# EAGLE design B (EAGLE 7.6.0)
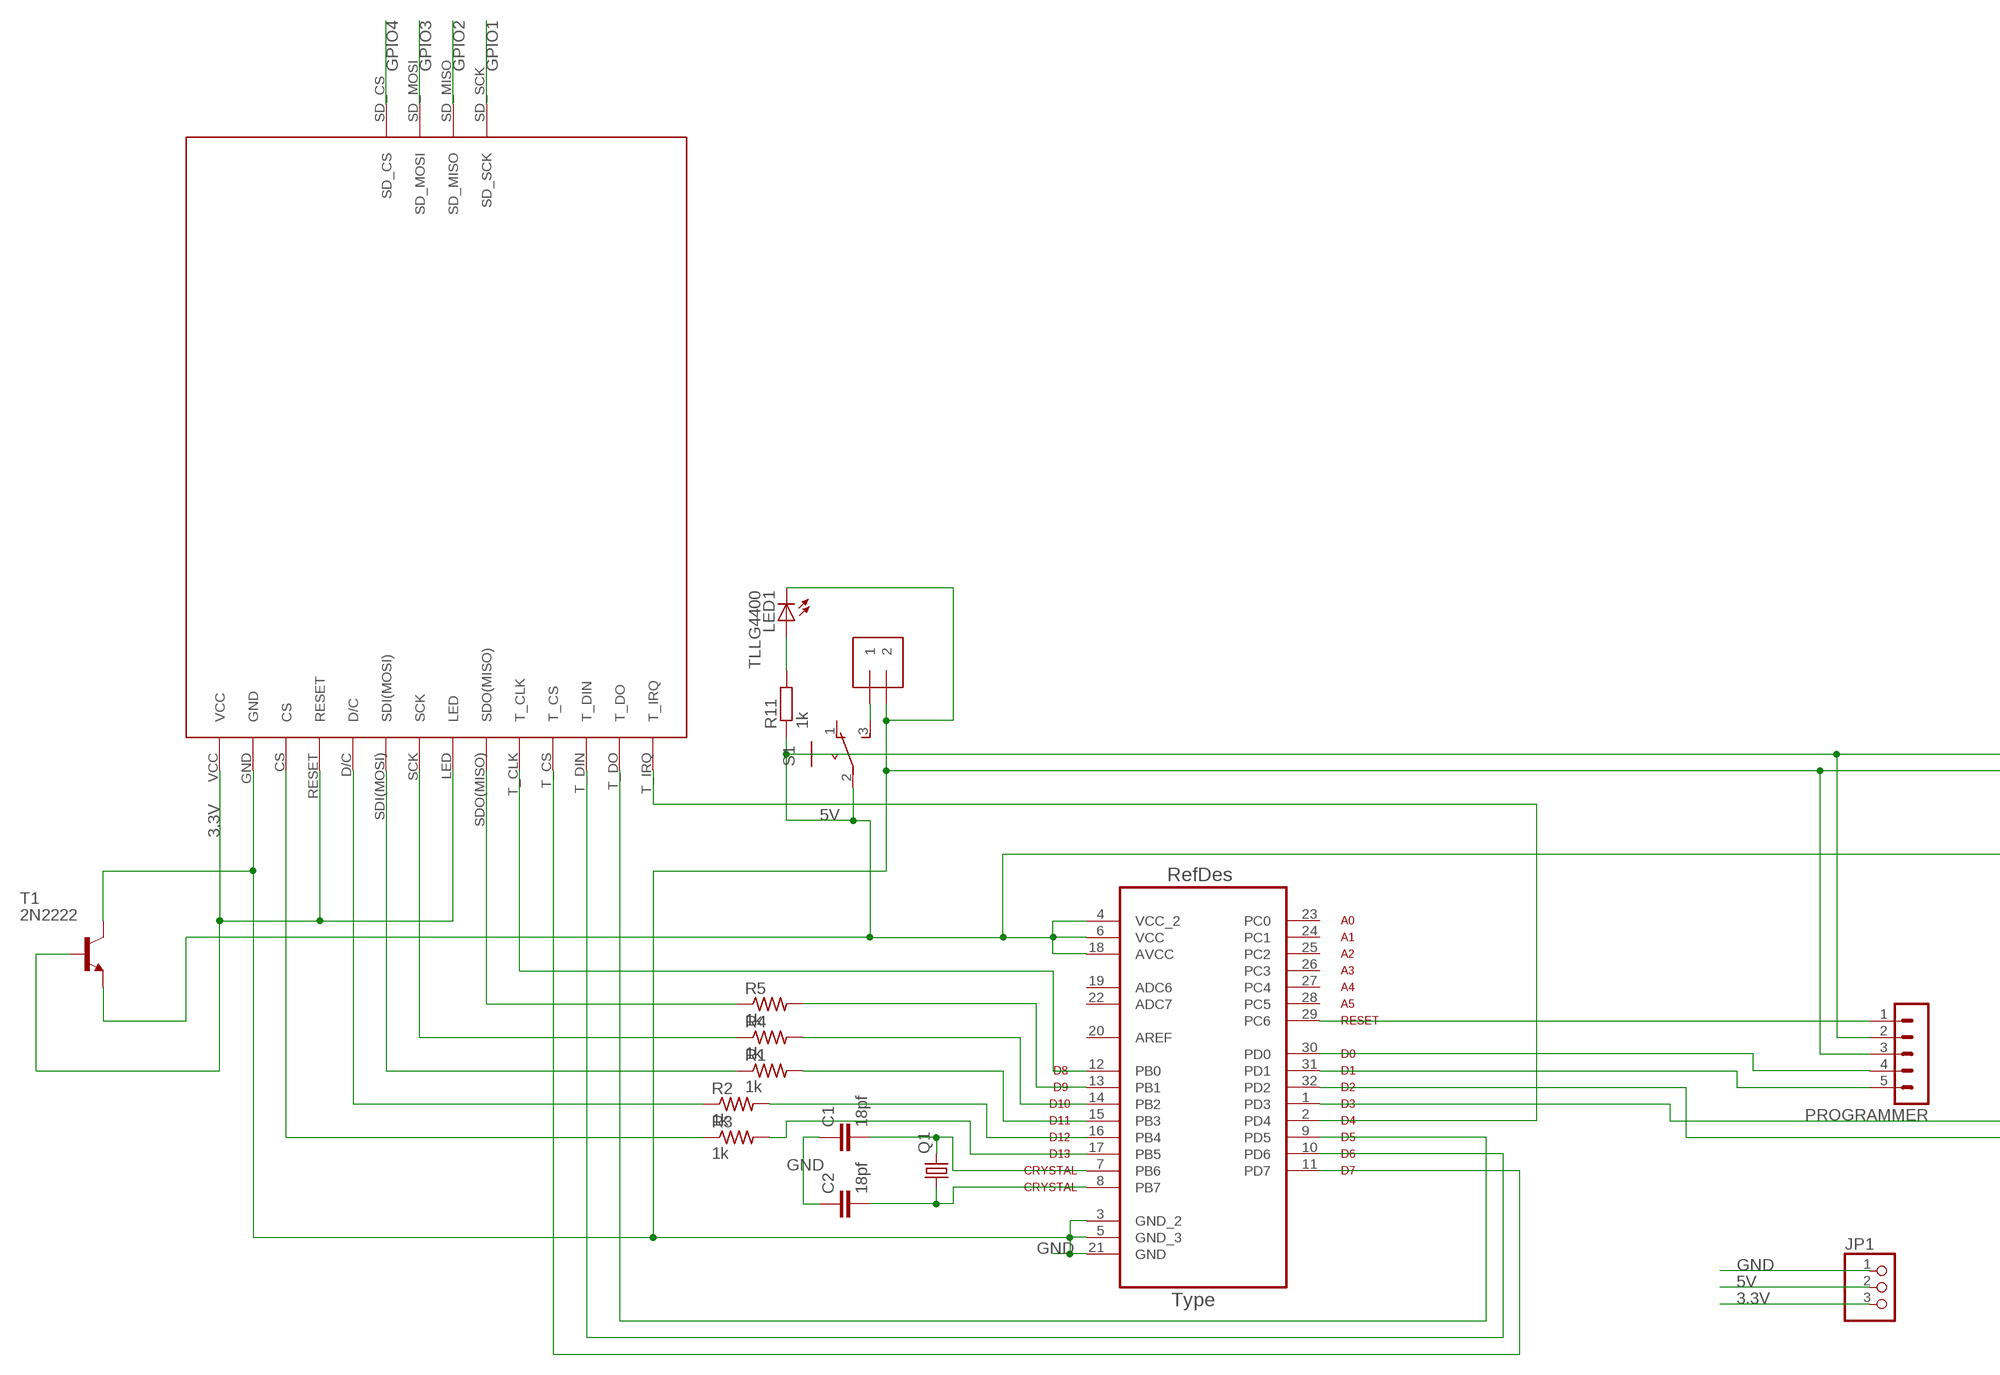
[diagram p0: schematic, sheet 1, part 1 of 2]
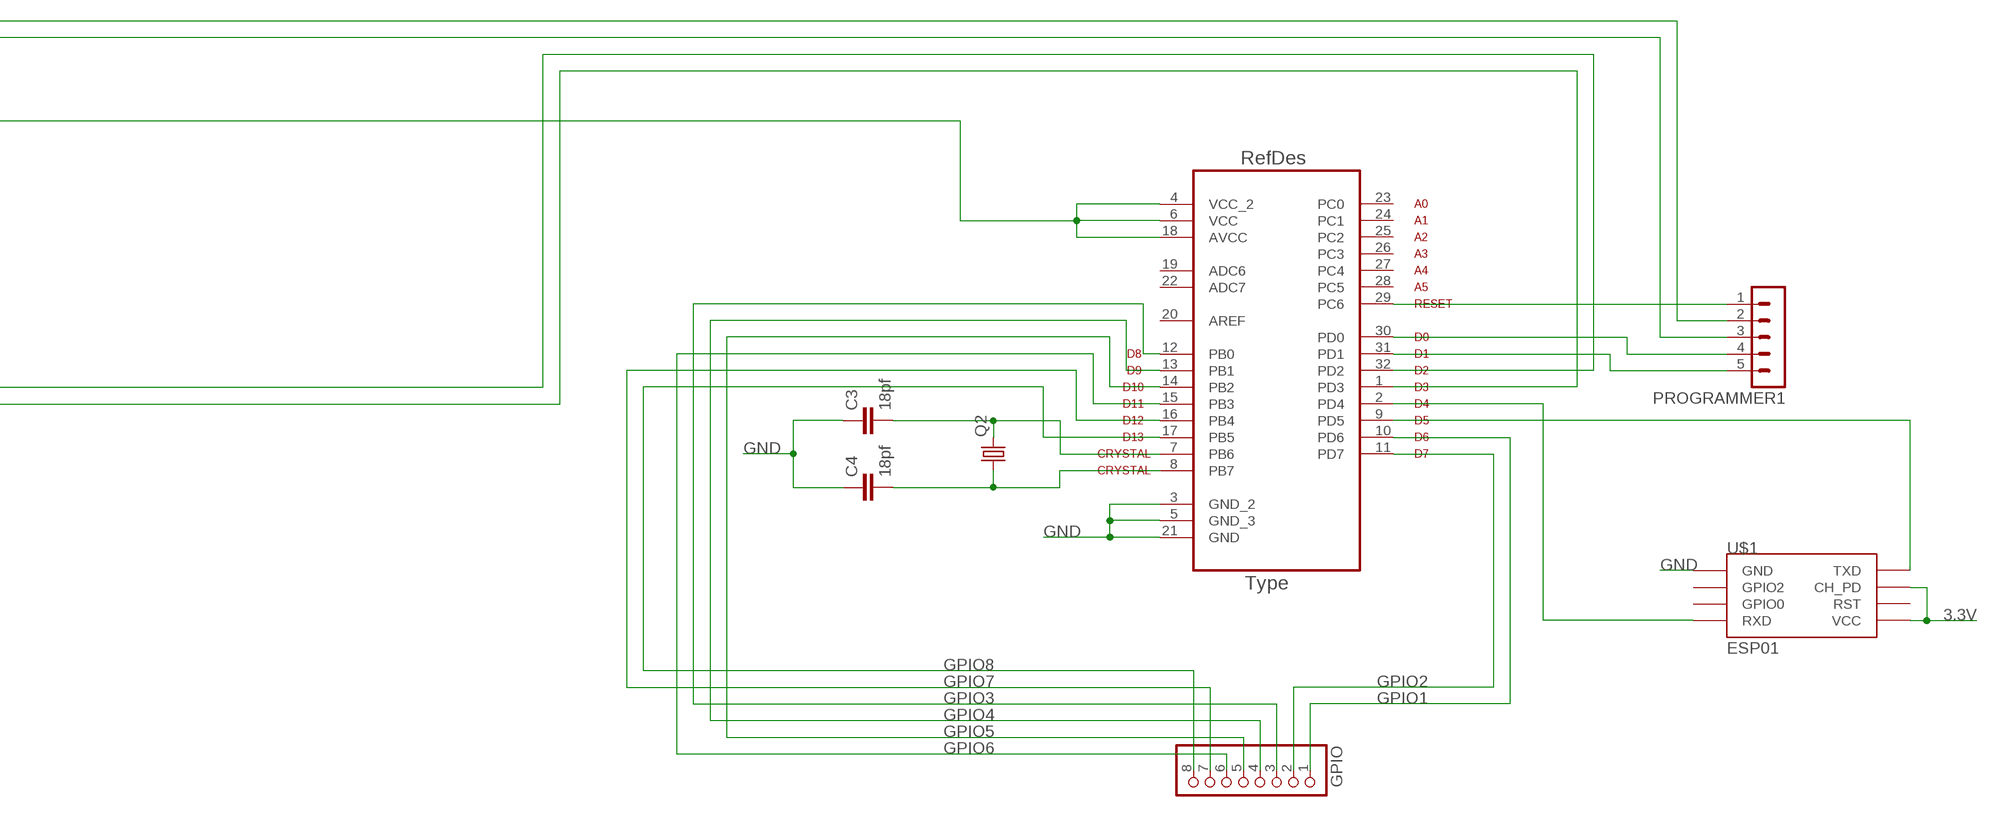
[diagram p1: schematic, sheet 1, part 2 of 2]

## Parts
C1  18pf  C2,5-3  [C2.5-3]
C2  18pf  C2,5-3  [C2.5-3]
C3  18pf  C2,5-3  [C2.5-3]
C4  18pf  C2,5-3  [C2.5-3]
DS2  DISPLAYSINATRA  [DISPLAYSINATRA]
GPIO  PINHD-1X8  [1X08]
JP1  PINHD-1X3  [1X03]
LED1  TLLG4400  [LED3MM]
POWER  1X2-3.5MM  [1X2-3.5MM]
PROGRAMMER  MA05-1  [MA05-1]
PROGRAMMER1  MA05-1  [MA05-1]
Q1  CRYSTALHC49S  [HC49/S]
Q2  CRYSTALHC49S  [HC49/S]
R1  1k  R-US_R1206  [R1206]
R2  1k  R-US_R1206  [R1206]
R3  1k  R-US_R1206  [R1206]
R4  1k  R-US_R1206  [R1206]
R5  1k  R-US_R1206  [R1206]
R11  1k  R-EU_0207/10  [0207/10]
S1  255SB  [255SB]
T1  2N2222  [TO92-EBC-OVAL]
U1  ATMEGA328P-AU  [QFP80P900X900X120-32N]
U2  ATMEGA328P-AU  [QFP80P900X900X120-32N]
U$1  ESP01  [ESP01]

## Nets
3.3V: DS2.LED DS2.RESET DS2.VCC JP1.3 T1.B U$1.CH_PD U$1.VCC
5V: JP1.2 PROGRAMMER1.2 PROGRAMMER.2 R11.1 S1.2(P) T1.E U1.4(VCC_2) U1.6(VCC) U1.18(AVCC) U2.4(VCC_2) U2.6(VCC) U2.18(AVCC)
GND: C1.1 C2.1 C3.1 C4.1 DS2.GND JP1.1 LED1.K(C) POWER.2 PROGRAMMER1.3 PROGRAMMER.3 T1.C U1.3(GND_2) U1.5(GND_3) U1.21(GND) U2.3(GND_2) U2.5(GND_3) U2.21(GND) U$1.GND
GPIO1: DS2.SD_SCK GPIO.1 U2.10(PD6)
GPIO2: DS2.SD_MISO GPIO.2 U2.11(PD7)
GPIO3: DS2.SD_MOSI GPIO.3 U2.12(PB0)
GPIO4: DS2.SD_CS GPIO.4 U2.13(PB1)
GPIO5: GPIO.5 U2.14(PB2)
GPIO6: GPIO.6 U2.15(PB3)
GPIO7: GPIO.7 U2.16(PB4)
GPIO8: GPIO.8 U2.17(PB5)
N$1: C1.2 Q1.2 U1.7(PB6)
N$2: C2.2 Q1.1 U1.8(PB7)
N$3: R4.2 U1.14(PB2)
N$4: DS2.D/C R2.1
N$5: DS2.CS R3.1
N$6: DS2.SDI(MOSI) R1.1
N$7: DS2.SCK R4.1
N$8: DS2.SDO(MISO) R5.1
N$9: DS2.T_CLK U1.12(PB0)
N$10: DS2.T_CS U1.11(PD7)
N$11: DS2.T_DIN U1.10(PD6)
N$12: PROGRAMMER1.1 U2.29(PC6)
N$13: DS2.T_DO U1.9(PD5)
N$14: R1.2 U1.15(PB3)
N$15: R2.2 U1.16(PB4)
N$16: R3.2 U1.17(PB5)
N$17: R5.2 U1.13(PB1)
N$18: PROGRAMMER1.4 U2.30(PD0)
N$19: PROGRAMMER1.5 U2.31(PD1)
N$20: U1.1(PD3) U2.32(PD2)
N$22: U1.32(PD2) U2.1(PD3)
N$23: DS2.T_IRQ U1.2(PD4)
N$24: U2.2(PD4) U$1.RX(RXD)
N$25: C3.2 Q2.2 U2.7(PB6)
N$26: C4.2 Q2.1 U2.8(PB7)
N$27: U2.9(PD5) U$1.TX(TXD)
N$29: PROGRAMMER.1 U1.29(PC6)
N$30: PROGRAMMER.4 U1.30(PD0)
N$31: PROGRAMMER.5 U1.31(PD1)
N$32: LED1.A R11.2
N$33: POWER.1 S1.3(S)
Unconnected: S1.1(O) U1.19(ADC6) U1.20(AREF) U1.22(ADC7) U1.23(PC0) U1.24(PC1) U1.25(PC2) U1.26(PC3) U1.27(PC4) U1.28(PC5) U2.19(ADC6) U2.20(AREF) U2.22(ADC7) U2.23(PC0) U2.24(PC1) U2.25(PC2) U2.26(PC3) U2.27(PC4) U2.28(PC5) U$1.GPIO0 U$1.GPIO2 U$1.RST

## Library data of the parts
C1-C4 = capacitor-wima:C: CAPACITOR naming: grid - package width
DS2 = DisplaySinatra:DISPLAYSINATRA
GPIO = pinhead:PINHD-1X8: PIN HEADER
JP1 = pinhead:PINHD-1X3: PIN HEADER
LED1 = led:TLLG4400: Low Current (2mA) LED 3 mm Tinted Diffused Package color GREEN Source: Data sheet <http://www.farnell.com/datasheets/391098.pdf>; MF: VISHAY SEMICONDUCTOR; OC_FARNELL: 1612435
POWER = adafruit:1X2: 3.5mm Terminal block http://www.ladyada.net/library/pcb/eaglelibrary.html
PROGRAMMER PROGRAMMER1 = con-lstb:MA05-1: PIN HEADER; OC_FARNELL: unknown; OC_NEWARK: unknown
Q1 Q2 = adafruit:CRYSTAL: CRYSTAL; OC_FARNELL: 1667008; OC_NEWARK: unknown
R1-R5 = resistor:R-US_: RESISTOR, American symbol
R11 = resistor:R-EU_: RESISTOR, European symbol
S1 = switch:255SB: SLIDING SWITCH Distributor Buerklin, 11G810
T1 = adafruit:2N2222: NPN TRANSISTOR Big oval pads
U1 U2 = Atmel-ATMEGA328P-AU:ATMEGA328P-AU; DESCRIPTION: 8-bit Microcontroller with In-System Programmable Flash; MPN: ATMEGA328P-AU; OC_FARNELL: 1715486; OC_NEWARK: 14R4631; PACKAGE: TQFP-32; SUPPLIER: Atmel
U$1 = esp8266modules:ESP01: ESP8266 Wifi module 01

## Board
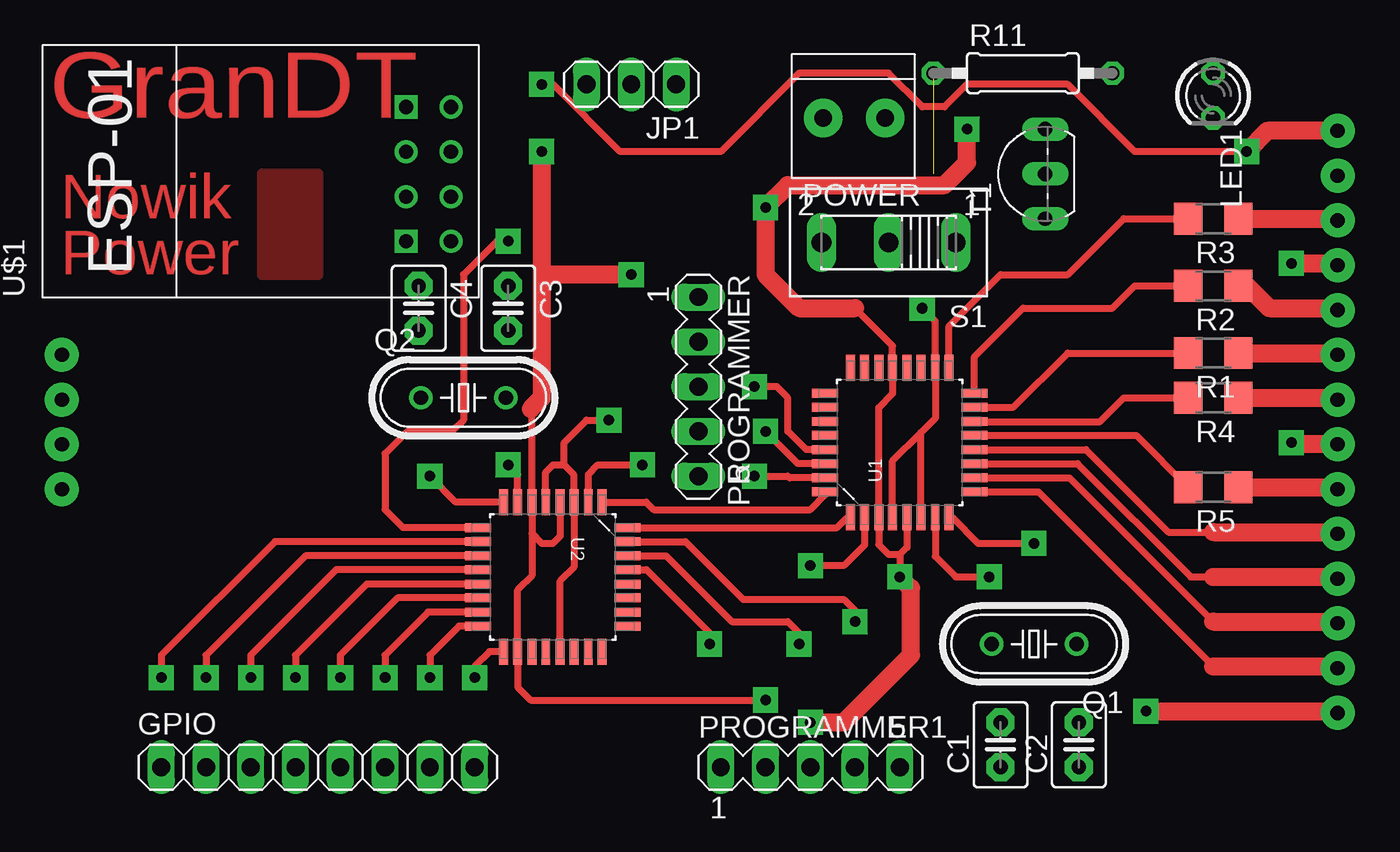
[diagram p2: board, top side]
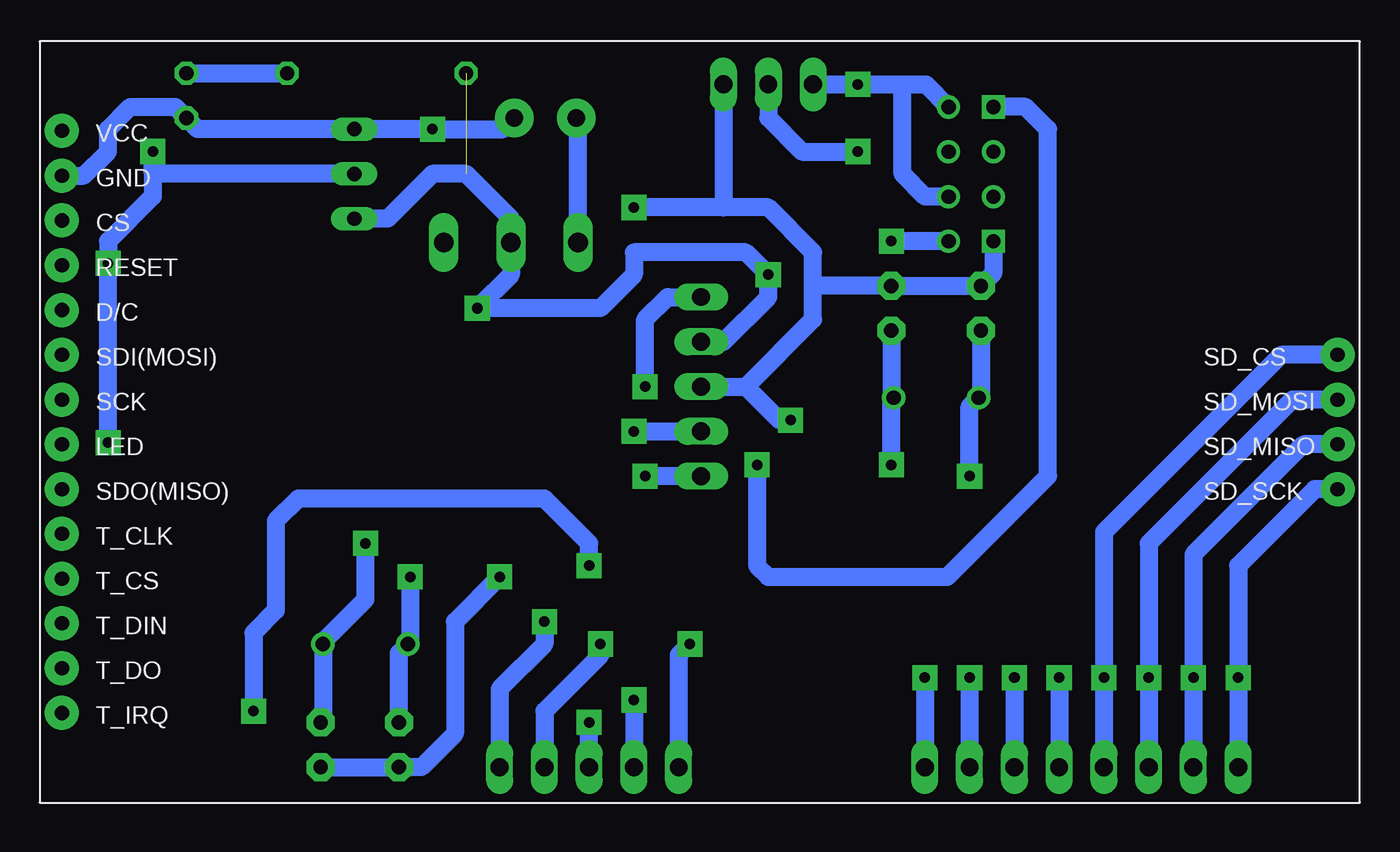
[diagram p3: board, bottom side, seen from below]

No outline drawn. Coordinates in mm, seen from the top.
Copper layers (1*16): Top 0.035mm / dielectric 1.5mm / Bottom 0.035mm
Design rules "default": minimum track width 10mil, minimum drill 24mil, track to track 8mil, track to pad 8mil, pad to pad 8mil, via to via 8mil, smd to smd 8mil, copper to edge 40mil, drill to drill 8mil, minimum pad ring 10mil, minimum via ring 8mil, stop-mask expansion 4mil, vias tented up to drill 0mil, thermal gap 10mil

### Footprints (pad centres in the part's own frame; a part is rotated, then mirrored left to right if it is on the bottom)
C2.5-3 = drill 0.813 pad 1.6 octagon: 1 -1.27,0; 2 1.27,0
DISPLAYSINATRA = drill 0.8 pad 1.93: CS -34.29,33.02; D/C -34.29,27.94; GND -34.29,35.56; LED -34.29,20.32; RESET -34.29,30.48; SCK -34.29,22.86; SD_CS 38.1,25.4; SD_MISO 38.1,20.32; SD_MOSI 38.1,22.86; SD_SCK 38.1,17.78; SDI(MOSI) -34.29,25.4; SDO(MISO) -34.29,17.78; T_CLK -34.29,15.24; T_CS -34.29,12.7; T_DIN -34.29,10.16; T_DO -34.29,7.62; T_IRQ -34.29,5.08; VCC -34.29,38.1
1X08 = drill 1.016 long: 1 -8.89,0; 2 -6.35,0; 3 -3.81,0; 4 -1.27,0; 5 1.27,0; 6 3.81,0; 7 6.35,0; 8 8.89,0
1X03 = drill 1.016 long: 1 -2.54,0; 2 0,0; 3 2.54,0
LED3MM = drill 0.813 octagon: A -1.27,0; K 1.27,0
1X2-3.5MM = drill 1 pad 2.184: 1 1.8,0; 2 -1.7,0
MA05-1 = drill 1.016 long: 1 -5.08,0; 2 -2.54,0; 3 0,0; 4 2.54,0; 5 5.08,0
HC49/S = drill 0.813: 1 -2.413,0; 2 2.413,0
R1206 = smd 1.6 x 1.803: 1 -1.422,0; 2 1.422,0
0207/10 = drill 0.813 octagon: 1 -5.08,0; 2 5.08,0
255SB = drill 1.118 long: 1 -3.81,0; 2 0,0; 3 3.81,0
TO92-EBC-OVAL = drill 0.813 long: B 0,-1.27; C 2.54,-1.27; E -2.54,-1.27
QFP80P900X900X120-32N = smd 1.473 x 0.508: 1 -4.242,2.794; 2 -4.242,2.007; 3 -4.242,1.194; 4 -4.242,0.406; 5 -4.242,-0.406; 6 -4.242,-1.194; 7 -4.242,-2.007; 8 -4.242,-2.794; 17 4.242,-2.794; 18 4.242,-2.007; 19 4.242,-1.194; 20 4.242,-0.406; 21 4.242,0.406; 22 4.242,1.194; 23 4.242,2.007; 24 4.242,2.794 | smd 0.508 x 1.473: 9 -2.794,-4.242; 10 -2.007,-4.242; 11 -1.194,-4.242; 12 -0.406,-4.242; 13 0.406,-4.242; 14 1.194,-4.242; 15 2.007,-4.242; 16 2.794,-4.242; 25 2.794,4.242; 26 2.007,4.242; 27 1.194,4.242; 28 0.406,4.242; 29 -0.406,4.242; 30 -1.194,4.242; 31 -2.007,4.242; 32 -2.794,4.242
ESP01 = drill 0.8: CH_PD -1.285,-8.178; GPIO0 1.255,-5.638; GPIO2 -1.285,-5.638; RST 1.255,-8.178; TX -3.825,-8.178; VCC 3.795,-8.178 | drill 0.8 square: GND -3.825,-5.638; RX 3.795,-5.638

### Placement (x,y rotation side)
C1  29.21,-107.31 90 top
C2  33.66,-107.31 90 top
C3  1.27,-82.55 270 top
C4  -3.81,-82.55 270 top
DS2  14.05,-110.59 0 bottom
GPIO  -9.53,-108.58 0 top
JP1  8.26,-69.85 180 top
LED1  41.27,-70.48 270 top
POWER  20.95,-71.75 180 top
PROGRAMMER  12.06,-87 270 top
PROGRAMMER1  18.41,-108.58 0 top
Q1  31.11,-101.6 180 top
Q2  -1.27,-87.63 0 top
R1  41.27,-85.09 180 top
R2  41.27,-81.28 180 top
R3  41.27,-77.47 180 top
R4  41.27,-87.63 180 top
R5  41.27,-92.71 180 top
R11  30.48,-69.22 0 top
S1  22.86,-78.82 180 top
T1  30.48,-74.93 90 top
U1  23.5,-90.17 90 top
U2  3.81,-97.79 270 top
U$1  -10.16,-74.93 90 top

### Tracks (layer width: path | path; a pad name or v marks a point on that pad's centre or on a via)
3.3V  (via drill 0.6 pad 1.42)
  Top 0.406: v43.18,-73.66 36.83,-73.66 33.02,-69.85 27.3,-69.85 26.04,-71.12 24.77,-71.12 22.86,-69.22 17.78,-69.22 13.34,-73.66 7.62,-73.66 3.81,-69.85 v3.17,-69.85
  Top 1.016: DS2.VCC 44.35,-72.49 v43.18,-73.66 | v45.72,-80.01 48.23,-80.01 DS2.RESET | DS2.LED 45.82,-90.27 v45.72,-90.17
  Bottom 1.016: 43.18,-74.93 43.18,-76.2 45.72,-78.74 v45.72,-80.01 v45.72,-90.17 | JP1.3 v3.17,-69.85 0.64,-69.85 | 0.64,-69.85 -0.7,-69.85 U$1.VCC -1.92,-71.14 -1.91,-71.12 | U$1.CH_PD -0.65,-76.22 0.64,-74.93 0.64,-69.85 | T1.B 43.18,-74.93 | 43.18,-74.93 v43.18,-73.66
5V  (via drill 0.6 pad 1.42)  (1 unrouted)
  Top 0.406: U1.6 24.69,-89.61 | 24.69,-89.61 25.5,-88.8 U1.18 25.5,-83.29 v24.77,-82.55 | U1.4 23.09,-91.21 24.69,-89.61 | U2.6 2.62,-95.33 3.17,-95.89 3.81,-95.89 4.22,-95.48 U2.4 | U2.6 2.62,-97.71 1.8,-98.53 U2.18 1.8,-104.04 2.54,-104.78 v15.88,-104.78 | U2.6 2.62,-88.34 2.54,-88.27
  Top 1.016: v8.26,-80.64 3.17,-80.64 | 3.17,-80.64 3.17,-81.28 3.17,-87.63 2.54,-88.27 | v3.17,-73.66 3.17,-80.64
  Bottom 1.016: PROGRAMMER.2 10.79,-84.45 8.26,-81.92 v8.26,-80.64 9.53,-79.38 15.88,-79.38 15.88,-80.64 17.78,-82.55 v24.77,-82.55 22.86,-80.64 S1.2 22.86,-77.47 25.4,-74.93 27.3,-74.93 29.84,-77.47 T1.E | v15.88,-104.78 PROGRAMMER1.2 | JP1.2 8.26,-71.75 6.35,-73.66 v3.17,-73.66
GND  (via drill 0.6 pad 1.42)
  Top 0.406: U1.5 23.9,-96.11 23.5,-96.52 | 23.5,-96.52 22.86,-96.52 22.3,-95.96 U1.3 22.3,-88.19 23.09,-87.4 U1.21 23.09,-84.68 20.95,-82.55 | 23.5,-96.52 v23.5,-97.79 | U2.21 4.22,-98.02 5,-97.23 U2.3 5,-92 4.45,-91.44 | U2.5 3.4,-91.85 3.81,-91.44 4.45,-91.44 | 4.45,-91.44 4.45,-90.17 5.71,-88.9 v6.99,-88.9
  Top 1.016: v27.3,-72.39 27.3,-74.3 26.04,-75.56 17.14,-75.56 v15.88,-76.83 15.88,-80.64 17.78,-82.55 20.95,-82.55 | v18.41,-106.05 20.32,-106.05 24.13,-102.23 24.13,-98.42 v23.5,-97.79
  Bottom 1.016: DS2.GND 47.09,-75.03 45.72,-73.66 45.72,-72.39 44.45,-71.12 41.91,-71.12 LED1.K 40.64,-72.39 T1.C v27.3,-72.39 23.29,-72.39 POWER.2 | C2.1 C1.1 27.94,-108.58 26.04,-106.68 26.04,-100.33 v23.5,-97.79 | PROGRAMMER.3 9.53,-87 | 9.53,-87 5.71,-83.19 5.71,-81.28 | 5.71,-81.28 5.71,-79.38 8.26,-76.83 10.79,-76.83 | 10.79,-76.83 v15.88,-76.83 | v6.99,-88.9 7.62,-88.9 9.53,-87 | 5.71,-81.28 C3.1 C4.1 -4.52,-80.57 U$1.GND | JP1.1 10.79,-76.83 | PROGRAMMER1.3 v18.41,-106.05
GPIO1  (via drill 0.6 pad 1.42)
  Top 0.406: U2.10 -11.96,-95.78 -18.41,-102.23 v-18.41,-103.5
  Bottom 1.016: GPIO.1 v-18.41,-103.5 -18.41,-97.16 -22.76,-92.81 DS2.SD_SCK
GPIO2  (via drill 0.6 pad 1.42)
  Top 0.406: U2.11 -10.24,-96.6 -15.88,-102.23 v-15.88,-103.5
  Bottom 1.016: GPIO.2 v-15.88,-103.5 -15.88,-96.52 -22.12,-90.27 DS2.SD_MISO
GPIO3  (via drill 0.6 pad 1.42)
  Top 0.406: U2.12 -8.48,-97.38 -13.34,-102.23 v-13.34,-103.5
  Bottom 1.016: GPIO.3 v-13.34,-103.5 -13.34,-95.89 -21.49,-87.73 DS2.SD_MOSI
GPIO4  (via drill 0.6 pad 1.42)
  Top 0.406: U2.13 -6.76,-98.2 -10.79,-102.23 v-10.79,-103.5
  Bottom 1.016: GPIO.4 v-10.79,-103.5 -10.79,-95.25 -20.85,-85.19 DS2.SD_CS
GPIO5  (via drill 0.6 pad 1.42)
  Top 0.406: U2.14 -5,-98.98 -8.26,-102.23 v-8.26,-103.5
  Bottom 1.016: v-8.26,-103.5 GPIO.5
GPIO6  (via drill 0.6 pad 1.42)
  Top 0.406: U2.15 -3.28,-99.8 -5.71,-102.23 v-5.71,-103.5
  Bottom 1.016: v-5.71,-103.5 GPIO.6
GPIO7  (via drill 0.6 pad 1.42)
  Top 0.406: U2.16 -1.52,-100.58 -3.17,-102.23 v-3.17,-103.5
  Bottom 1.016: v-3.17,-103.5 GPIO.7
GPIO8  (via drill 0.6 pad 1.42)
  Top 0.406: U2.17 0.2,-102.03 -0.64,-102.87 v-0.64,-103.5
  Bottom 1.016: v-0.64,-103.5 GPIO.8
N$1  (via drill 0.6 pad 1.42)
  Top 0.406: U1.7 25.5,-96.62 26.67,-97.79 v28.57,-97.79
  Bottom 1.016: C1.2 29.21,-102.11 Q1.2 28.57,-101.47 v28.57,-97.79
N$2  (via drill 0.6 pad 1.42)
  Top 0.406: U1.8 26.47,-94.41 27.94,-95.89 v31.11,-95.89
  Bottom 1.016: C2.2 33.53,-105.92 Q1.1 33.66,-101.47 33.53,-101.47 31.11,-99.06 v31.11,-95.89
N$3
  Top 0.406: U1.14 34.85,-88.98 36.2,-87.63 R4.2
N$4
  Top 1.016: R2.1 43.18,-81.28 44.45,-82.55 48.23,-82.55 DS2.D/C
N$5
  Top 1.016: R3.1 48.34,-77.47 DS2.CS
N$6
  Top 1.016: R1.1 48.23,-85.09 DS2.SDI(MOSI)
N$7
  Top 1.016: 48.23,-87.63 DS2.SCK 48.34,-87.63 R4.1
N$8
  Top 1.016: 48.23,-92.71 DS2.SDO(MISO) 48.34,-92.71 R5.1
N$9
  Top 0.406: U1.12 34.06,-90.58 38.73,-95.25 41.27,-95.25
  Top 1.016: 41.27,-95.25 48.23,-95.25 DS2.T_CLK
N$10
  Top 0.406: U1.11 33.58,-91.36 40.01,-97.79 41.27,-97.79
  Top 1.016: 41.27,-97.79 48.23,-97.79 DS2.T_CS
N$11
  Top 0.406: U1.10 33.12,-92.18 41.27,-100.33
  Top 1.016: 41.27,-100.33 48.23,-100.33 DS2.T_DIN
N$12  (via drill 0.6 pad 1.42)
  Top 0.406: v12.7,-101.6 12.7,-100.97 9.12,-97.38 U2.29
  Bottom 1.016: v12.7,-101.6 13.34,-102.23 PROGRAMMER1.1
N$13
  Top 0.406: U1.9 31.37,-92.96 41.27,-102.87
  Top 1.016: 41.27,-102.87 48.23,-102.87 DS2.T_DO
N$14
  Top 0.406: U1.15 29.95,-88.16 33.02,-85.09 R1.2
N$15
  Top 0.406: U1.16 27.74,-85.29 30.48,-82.55 35.56,-82.55 36.83,-81.28 R2.2
N$16
  Top 0.406: U1.17 26.29,-83.57 29.21,-80.64 33.02,-80.64 36.2,-77.47 R3.2
N$17
  Top 0.406: U1.13 36.91,-89.76 R5.2
N$18  (via drill 0.6 pad 1.42)
  Top 0.406: v17.78,-101.6 17.78,-100.97 17.14,-100.33 13.97,-100.33 10.24,-96.6 U2.30
  Bottom 1.016: v17.78,-101.6 17.78,-102.23 20.95,-105.41 PROGRAMMER1.4
N$19  (via drill 0.6 pad 1.42)
  Top 0.406: v20.95,-100.33 20.95,-99.69 20.32,-99.06 14.61,-99.06 11.33,-95.78 U2.31
  Bottom 1.016: v20.95,-100.33 20.95,-101.6 23.5,-104.14 PROGRAMMER1.5
N$20
  Top 0.406: U2.32 19.94,-95 20.32,-94.61 | 20.32,-94.61 20.52,-94.41 U1.1 20.5,-94.61 20.32,-94.61
N$21
  pour Top: -12.7,-74.93 -12.7,-80.64 -9.53,-80.64 -9.53,-74.93
N$22
  Top 0.406: U2.1 9.09,-93.55 9.53,-93.98 18.41,-93.98 19.25,-93.14 U1.32
N$23  (via drill 0.6 pad 1.42)
  Top 0.406: U1.2 21.49,-95.99 20.32,-97.16 v18.41,-97.16
  Top 1.016: v37.47,-105.41 48.23,-105.41 DS2.T_IRQ
  Bottom 1.016: v18.41,-97.16 18.41,-95.89 20.95,-93.34 34.92,-93.34 36.2,-94.61 36.2,-99.69 37.47,-100.97 v37.47,-105.41
N$24  (via drill 0.6 pad 1.42)
  Top 0.406: U2.2 5.82,-91.97 6.35,-91.44 v8.89,-91.44
  Bottom 1.016: v8.89,-91.44 8.89,-97.16 8.26,-97.79 -1.91,-97.79 -7.62,-92.08 -7.62,-72.39 -6.35,-71.12 -4.54,-71.12 U$1.RX
N$25  (via drill 0.6 pad 1.42)
  Top 0.406: U2.7 1.8,-91.97 v1.27,-91.44
  Bottom 1.016: C3.2 1.27,-87.5 Q2.2 1.27,-87.76 v1.27,-91.44
N$26  (via drill 0.6 pad 1.42)
  Top 0.406: U2.8 -1.7,-93.55 v-3.17,-92.08
  Bottom 1.016: C4.2 -3.81,-87.5 Q2.1 -3.17,-88.14 v-3.17,-92.08
N$27  (via drill 0.6 pad 1.42)
  Top 0.406: v1.27,-78.74 0.64,-78.74 -1.27,-80.64 -1.27,-88.9 -1.91,-89.53 -4.45,-89.53 -5.71,-90.81 -5.71,-93.98 -4.7,-95 U2.9
  Bottom 1.016: U$1.TX 1.25,-78.75 v1.27,-78.74
N$29  (via drill 0.6 pad 1.42)
  Top 0.406: U1.29 18.19,-90.58 17.14,-89.53 17.14,-87.63 16.51,-87 v15.24,-87
  Bottom 1.016: v15.24,-87 15.24,-83.19 13.97,-81.92 PROGRAMMER.1
N$30  (via drill 0.6 pad 1.42)
  Top 0.406: U1.30 17.7,-91.36 v15.88,-89.53
  Bottom 1.016: v15.88,-89.53 PROGRAMMER.4
N$31  (via drill 0.6 pad 1.42)
  Top 0.406: v15.24,-92.08 17.14,-92.08 17.25,-92.18 U1.31
  Bottom 1.016: PROGRAMMER.5 v15.24,-92.08
N$32
  Bottom 1.016: LED1.A R11.2
N$33
  Bottom 1.016: S1.3 19.05,-71.86 POWER.1

### Text on the board
Top: GranDT | Nowik | Power